# EasyEDA Pro project DJ Controller Circuit.eprj

# Schematic Schematic1
Board Name: Board1; Create Date: 2025-10-14; Page Name: P1; Project Name: DJ Controller Circuit; Schematic Name: Schematic1; Update Date: 2025-10-14; Company: EasyEDA.com; Page Size: A4; Version: V1.0
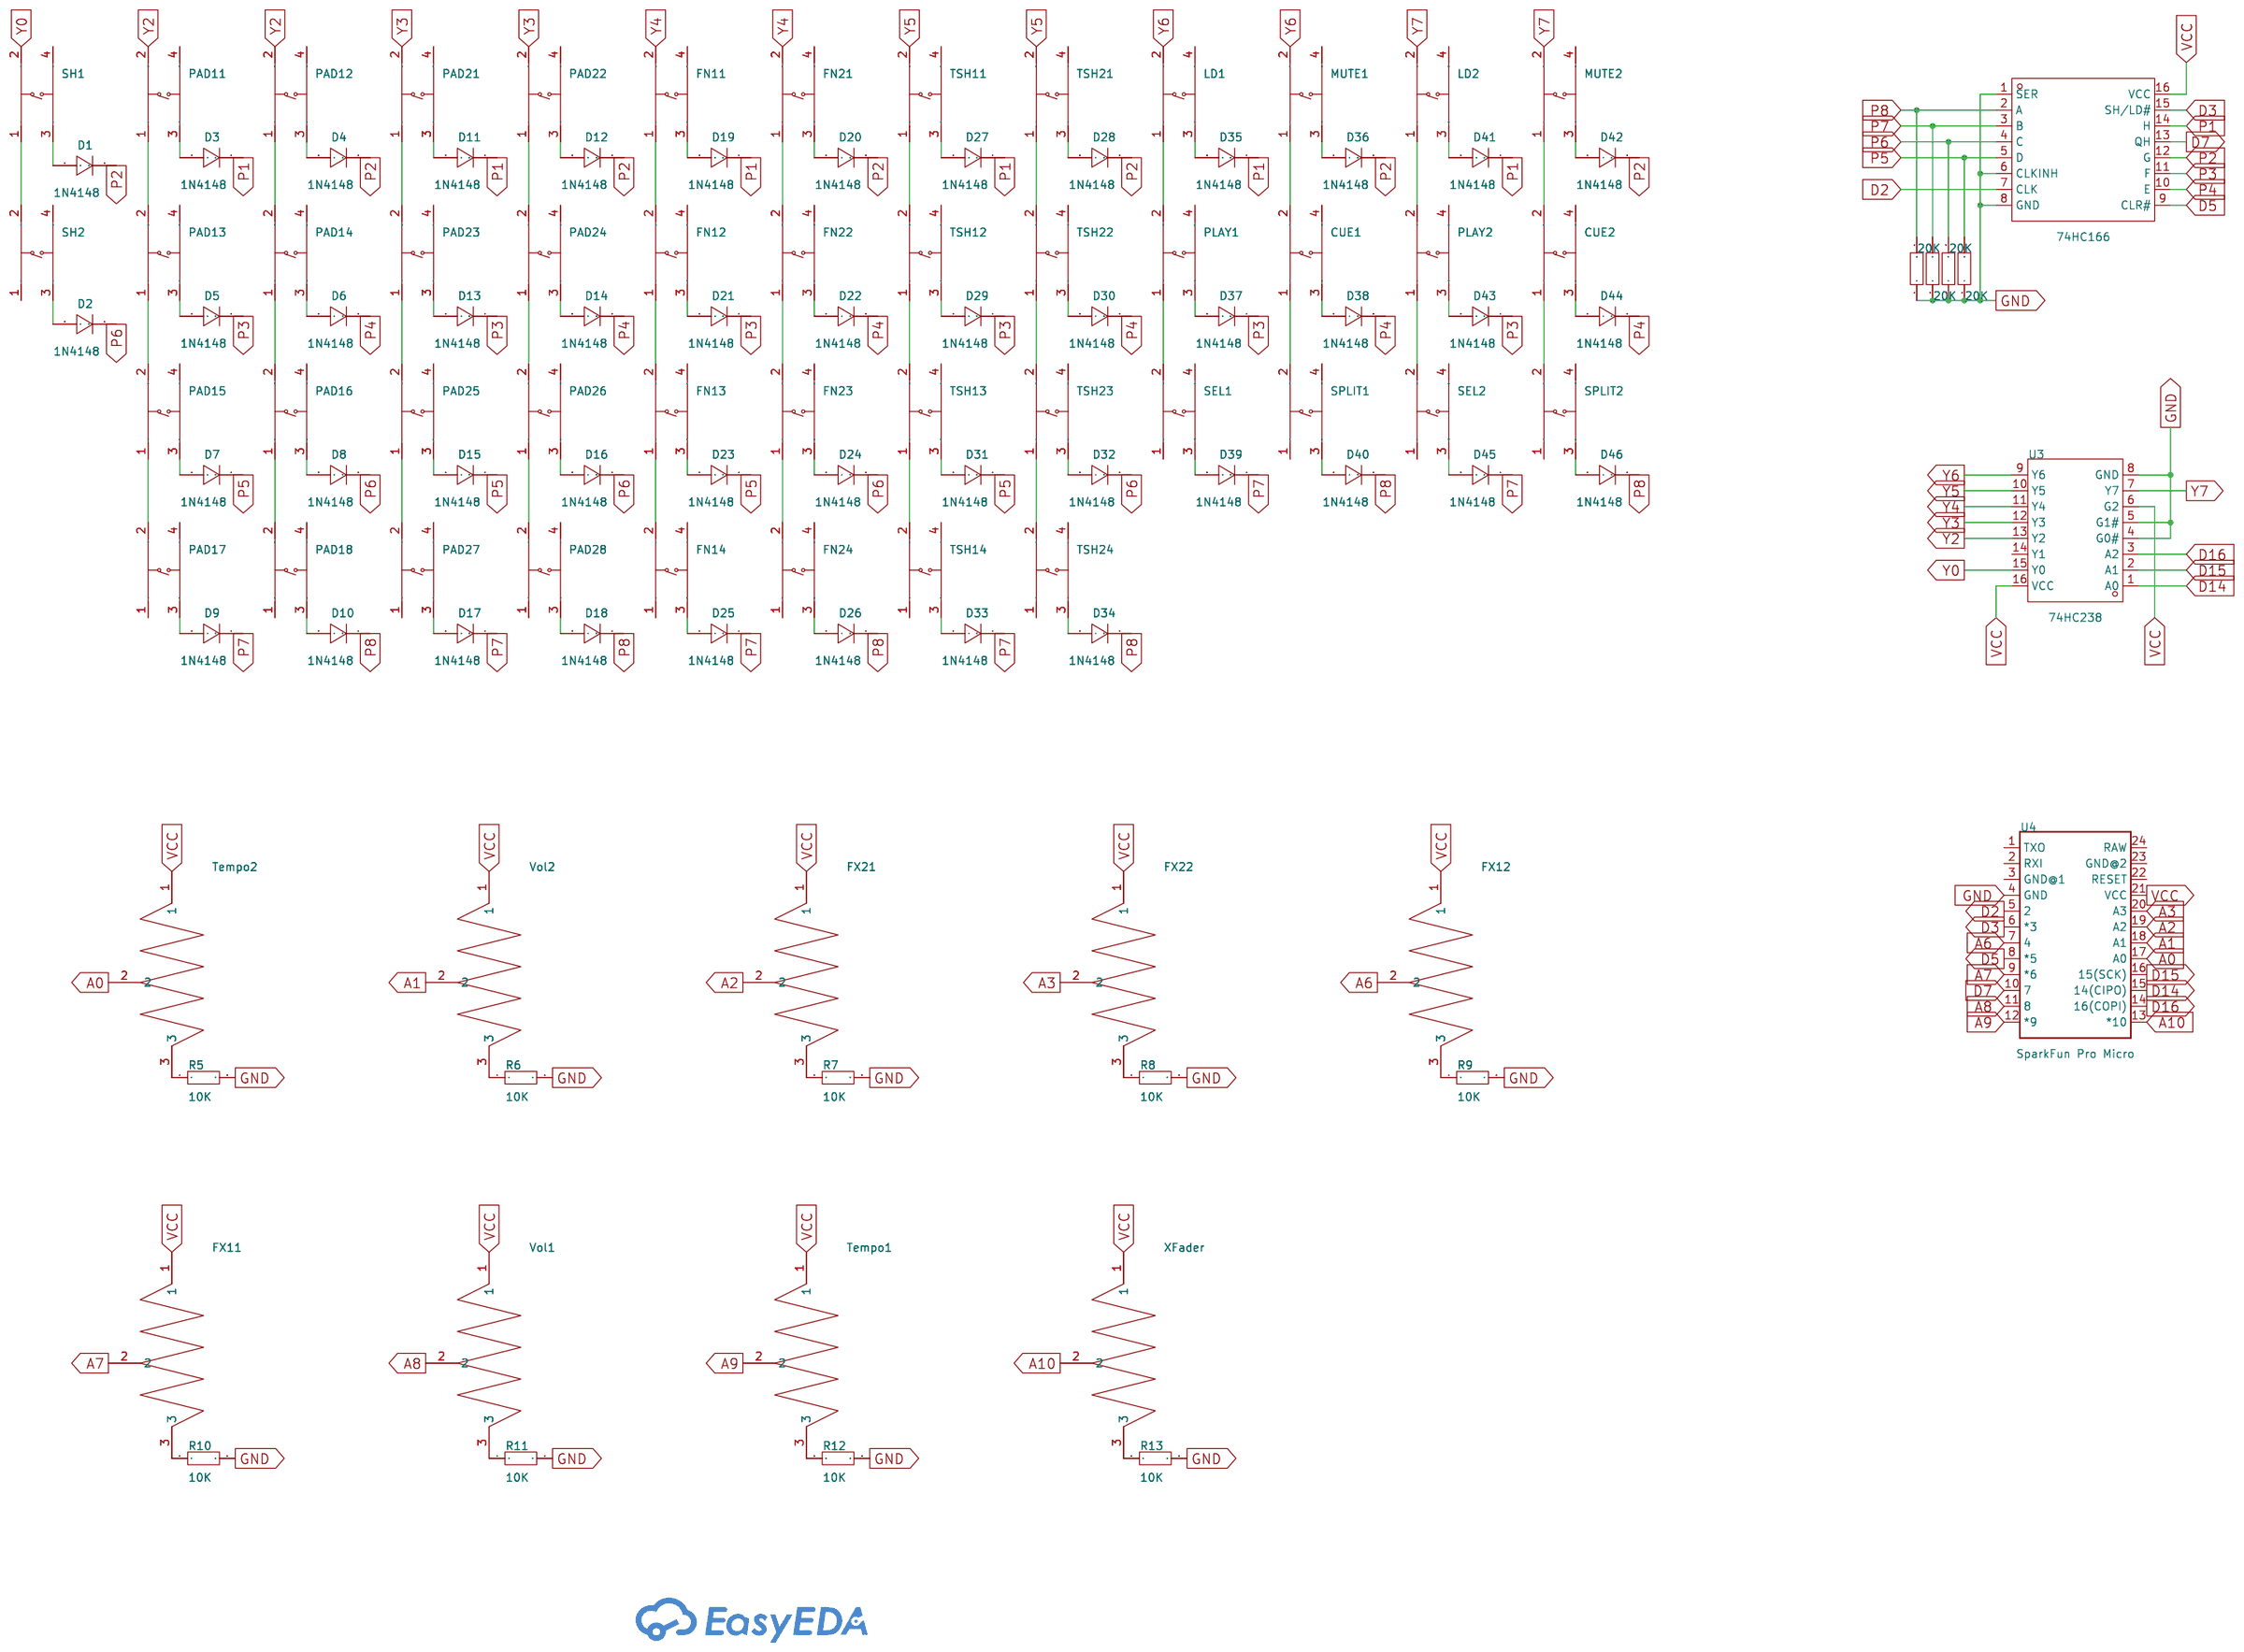
[diagram p0: schematic sheet]

## Parts
CUE1  TS665CJ  [SW-TH_4P-L6.0-W6.0-P4.50-LS6.5]
CUE2  TS665CJ  [SW-TH_4P-L6.0-W6.0-P4.50-LS6.5]
D1  1N4148  [DO-35_BD2.0-L4.2-P8.20-D0.5-RD]
D2  1N4148  [DO-35_BD2.0-L4.2-P8.20-D0.5-RD]
D3  1N4148  [DO-35_BD2.0-L4.2-P8.20-D0.5-RD]
D4  1N4148  [DO-35_BD2.0-L4.2-P8.20-D0.5-RD]
D5  1N4148  [DO-35_BD2.0-L4.2-P8.20-D0.5-RD]
D6  1N4148  [DO-35_BD2.0-L4.2-P8.20-D0.5-RD]
D7  1N4148  [DO-35_BD2.0-L4.2-P8.20-D0.5-RD]
D8  1N4148  [DO-35_BD2.0-L4.2-P8.20-D0.5-RD]
D9  1N4148  [DO-35_BD2.0-L4.2-P8.20-D0.5-RD]
D10  1N4148  [DO-35_BD2.0-L4.2-P8.20-D0.5-RD]
D11  1N4148  [DO-35_BD2.0-L4.2-P8.20-D0.5-RD]
D12  1N4148  [DO-35_BD2.0-L4.2-P8.20-D0.5-RD]
D13  1N4148  [DO-35_BD2.0-L4.2-P8.20-D0.5-RD]
D14  1N4148  [DO-35_BD2.0-L4.2-P8.20-D0.5-RD]
D15  1N4148  [DO-35_BD2.0-L4.2-P8.20-D0.5-RD]
D16  1N4148  [DO-35_BD2.0-L4.2-P8.20-D0.5-RD]
D17  1N4148  [DO-35_BD2.0-L4.2-P8.20-D0.5-RD]
D18  1N4148  [DO-35_BD2.0-L4.2-P8.20-D0.5-RD]
D19  1N4148  [DO-35_BD2.0-L4.2-P8.20-D0.5-RD]
D20  1N4148  [DO-35_BD2.0-L4.2-P8.20-D0.5-RD]
D21  1N4148  [DO-35_BD2.0-L4.2-P8.20-D0.5-RD]
D22  1N4148  [DO-35_BD2.0-L4.2-P8.20-D0.5-RD]
D23  1N4148  [DO-35_BD2.0-L4.2-P8.20-D0.5-RD]
D24  1N4148  [DO-35_BD2.0-L4.2-P8.20-D0.5-RD]
D25  1N4148  [DO-35_BD2.0-L4.2-P8.20-D0.5-RD]
D26  1N4148  [DO-35_BD2.0-L4.2-P8.20-D0.5-RD]
D27  1N4148  [DO-35_BD2.0-L4.2-P8.20-D0.5-RD]
D28  1N4148  [DO-35_BD2.0-L4.2-P8.20-D0.5-RD]
D29  1N4148  [DO-35_BD2.0-L4.2-P8.20-D0.5-RD]
D30  1N4148  [DO-35_BD2.0-L4.2-P8.20-D0.5-RD]
D31  1N4148  [DO-35_BD2.0-L4.2-P8.20-D0.5-RD]
D32  1N4148  [DO-35_BD2.0-L4.2-P8.20-D0.5-RD]
D33  1N4148  [DO-35_BD2.0-L4.2-P8.20-D0.5-RD]
D34  1N4148  [DO-35_BD2.0-L4.2-P8.20-D0.5-RD]
D35  1N4148  [DO-35_BD2.0-L4.2-P8.20-D0.5-RD]
D36  1N4148  [DO-35_BD2.0-L4.2-P8.20-D0.5-RD]
D37  1N4148  [DO-35_BD2.0-L4.2-P8.20-D0.5-RD]
D38  1N4148  [DO-35_BD2.0-L4.2-P8.20-D0.5-RD]
D39  1N4148  [DO-35_BD2.0-L4.2-P8.20-D0.5-RD]
D40  1N4148  [DO-35_BD2.0-L4.2-P8.20-D0.5-RD]
D41  1N4148  [DO-35_BD2.0-L4.2-P8.20-D0.5-RD]
D42  1N4148  [DO-35_BD2.0-L4.2-P8.20-D0.5-RD]
D43  1N4148  [DO-35_BD2.0-L4.2-P8.20-D0.5-RD]
D44  1N4148  [DO-35_BD2.0-L4.2-P8.20-D0.5-RD]
D45  1N4148  [DO-35_BD2.0-L4.2-P8.20-D0.5-RD]
D46  1N4148  [DO-35_BD2.0-L4.2-P8.20-D0.5-RD]
FN11  TS665CJ  [SW-TH_4P-L6.0-W6.0-P4.50-LS6.5]
FN12  TS665CJ  [SW-TH_4P-L6.0-W6.0-P4.50-LS6.5]
FN13  TS665CJ  [SW-TH_4P-L6.0-W6.0-P4.50-LS6.5]
FN14  TS665CJ  [SW-TH_4P-L6.0-W6.0-P4.50-LS6.5]
FN21  TS665CJ  [SW-TH_4P-L6.0-W6.0-P4.50-LS6.5]
FN22  TS665CJ  [SW-TH_4P-L6.0-W6.0-P4.50-LS6.5]
FN23  TS665CJ  [SW-TH_4P-L6.0-W6.0-P4.50-LS6.5]
FN24  TS665CJ  [SW-TH_4P-L6.0-W6.0-P4.50-LS6.5]
FX11  -  [WIW3386P]
FX12  -  [WIW3386P]
FX21  -  [WIW3386P]
FX22  -  [WIW3386P]
LD1  TS665CJ  [SW-TH_4P-L6.0-W6.0-P4.50-LS6.5]
LD2  TS665CJ  [SW-TH_4P-L6.0-W6.0-P4.50-LS6.5]
MUTE1  TS665CJ  [SW-TH_4P-L6.0-W6.0-P4.50-LS6.5]
MUTE2  TS665CJ  [SW-TH_4P-L6.0-W6.0-P4.50-LS6.5]
PAD11  TS665CJ  [SW-TH_4P-L6.0-W6.0-P4.50-LS6.5]
PAD12  TS665CJ  [SW-TH_4P-L6.0-W6.0-P4.50-LS6.5]
PAD13  TS665CJ  [SW-TH_4P-L6.0-W6.0-P4.50-LS6.5]
PAD14  TS665CJ  [SW-TH_4P-L6.0-W6.0-P4.50-LS6.5]
PAD15  TS665CJ  [SW-TH_4P-L6.0-W6.0-P4.50-LS6.5]
PAD16  TS665CJ  [SW-TH_4P-L6.0-W6.0-P4.50-LS6.5]
PAD17  TS665CJ  [SW-TH_4P-L6.0-W6.0-P4.50-LS6.5]
PAD18  TS665CJ  [SW-TH_4P-L6.0-W6.0-P4.50-LS6.5]
PAD21  TS665CJ  [SW-TH_4P-L6.0-W6.0-P4.50-LS6.5]
PAD22  TS665CJ  [SW-TH_4P-L6.0-W6.0-P4.50-LS6.5]
PAD23  TS665CJ  [SW-TH_4P-L6.0-W6.0-P4.50-LS6.5]
PAD24  TS665CJ  [SW-TH_4P-L6.0-W6.0-P4.50-LS6.5]
PAD25  TS665CJ  [SW-TH_4P-L6.0-W6.0-P4.50-LS6.5]
PAD26  TS665CJ  [SW-TH_4P-L6.0-W6.0-P4.50-LS6.5]
PAD27  TS665CJ  [SW-TH_4P-L6.0-W6.0-P4.50-LS6.5]
PAD28  TS665CJ  [SW-TH_4P-L6.0-W6.0-P4.50-LS6.5]
PLAY1  TS665CJ  [SW-TH_4P-L6.0-W6.0-P4.50-LS6.5]
PLAY2  TS665CJ  [SW-TH_4P-L6.0-W6.0-P4.50-LS6.5]
R1  20K  [RES-TH_BD2.3-L6.5-P10.50-D0.5]
R2  20K  [RES-TH_BD2.3-L6.5-P10.50-D0.5]
R3  20K  [RES-TH_BD2.3-L6.5-P10.50-D0.5]
R4  20K  [RES-TH_BD2.3-L6.5-P10.50-D0.5]
R5  10K  [RES-TH_BD2.3-L6.5-P10.50-D0.5]
R6  10K  [RES-TH_BD2.3-L6.5-P10.50-D0.5]
R7  10K  [RES-TH_BD2.3-L6.5-P10.50-D0.5]
R8  10K  [RES-TH_BD2.3-L6.5-P10.50-D0.5]
R9  10K  [RES-TH_BD2.3-L6.5-P10.50-D0.5]
R10  10K  [RES-TH_BD2.3-L6.5-P10.50-D0.5]
R11  10K  [RES-TH_BD2.3-L6.5-P10.50-D0.5]
R12  10K  [RES-TH_BD2.3-L6.5-P10.50-D0.5]
R13  10K  [RES-TH_BD2.3-L6.5-P10.50-D0.5]
SEL1  TS665CJ  [SW-TH_4P-L6.0-W6.0-P4.50-LS6.5]
SEL2  TS665CJ  [SW-TH_4P-L6.0-W6.0-P4.50-LS6.5]
SH1  TS665CJ  [SW-TH_4P-L6.0-W6.0-P4.50-LS6.5]
SH2  TS665CJ  [SW-TH_4P-L6.0-W6.0-P4.50-LS6.5]
SPLIT1  TS665CJ  [SW-TH_4P-L6.0-W6.0-P4.50-LS6.5]
SPLIT2  TS665CJ  [SW-TH_4P-L6.0-W6.0-P4.50-LS6.5]
Tempo1  -  [DM4070]
Tempo2  -  [DM4070]
TSH11  TS665CJ  [SW-TH_4P-L6.0-W6.0-P4.50-LS6.5]
TSH12  TS665CJ  [SW-TH_4P-L6.0-W6.0-P4.50-LS6.5]
TSH13  TS665CJ  [SW-TH_4P-L6.0-W6.0-P4.50-LS6.5]
TSH14  TS665CJ  [SW-TH_4P-L6.0-W6.0-P4.50-LS6.5]
TSH21  TS665CJ  [SW-TH_4P-L6.0-W6.0-P4.50-LS6.5]
TSH22  TS665CJ  [SW-TH_4P-L6.0-W6.0-P4.50-LS6.5]
TSH23  TS665CJ  [SW-TH_4P-L6.0-W6.0-P4.50-LS6.5]
TSH24  TS665CJ  [SW-TH_4P-L6.0-W6.0-P4.50-LS6.5]
U2  74HC166  [DIP-16_L20.0-W6.4-P2.54-LS7.6-BL]
U3  74HC238  [PDIP-16_L19.3-W6.4-P2.54-LS7.9-BL]
U4  SparkFun Pro Micro  [SPARKFUN_PRO_MICRO]
Vol1  -  [DM4070]
Vol2  -  [DM4070]
XFader  -  [DM4070]

## Library data of the parts
CUE1 CUE2 FN11-FN14 FN21-FN24 LD1 LD2 MUTE1 MUTE2 PAD11-PAD18 PAD21-PAD28 PLAY1 PLAY2 SEL1 SEL2 SH1 SH2 SPLIT1 SPLIT2 TSH11-TSH14 TSH21-TSH24 = TS665CJ: LCSC Part Name: 6*6*5mm 直插 轻触开关; Supplier Part: C393938; Manufacturer: SHOU HAN(首韩); Supplier Footprint: 插件; JLCPCB Part Class: Extended Part; Datasheet: https://atta.szlcsc.com/upload/public/pdf/source/20190521/C393938_BDABEAC600B4C55E200A80AA129B70BC.pdf; Supplier: LCSC; Circuit: SPST; Actuator Style: Round Button; Mounting Style: Straight; Switch Length: 6mm; Switch Width: 6mm; Switch Height: 5mm; Contact Current: 50mA; Voltage Rating (DC): 12V
D1-D46 = 1N4148_C85057: Supplier Part: C85057; Manufacturer: 星海; Supplier Footprint: DO-35; JLCPCB Part Class: Extended Part; Datasheet: https://item.szlcsc.com/datasheet/1N4148/86229.html; Supplier: LCSC; Voltage - Forward(Vf@If): 1V@10mA; Voltage - DC Reverse(Vr): 100V; Current - Rectified: 150mA; Pd - Power Dissipation: 500mW; Reverse Leakage Current (Ir): 5uA@75V; Reverse Recovery Time (trr): 4ns; Operating Junction Temperature Range: -65℃~+200℃@(Tj); Non-Repetitive Peak Forward Surge Current: 500mA
FX11 FX12 FX21 FX22 Tempo1 Tempo2 Vol1 Vol2 XFader = DM4070
R1-R13 = Res_0603: Supplier Footprint: 0603
U2 = SN74HC166N: LCSC Part Name: 推挽式输出 8位并行或串行至串行移位寄存器; Supplier Part: C2905; Manufacturer: TI(德州仪器); Supplier Footprint: DIP-16; JLCPCB Part Class: Extended Part; Datasheet: https://www.ti.com/cn/lit/gpn/sn74hc166; Supplier: LCSC; Function: ParallelorSerialtoSerial; Supply Voltage: 2V~6V; Number of Elements: 1; Number of Bits per Element: 8; Output Type: Push-pull; Operating Temperature: -40℃~+85℃
U3 = CD74HC238E: Supplier Part: C1547095; Manufacturer: TI(德州仪器); Supplier Footprint: PDIP-16; JLCPCB Part Class: Extended Part; Datasheet: https://www.ti.com/cn/lit/gpn/cd74hc238; Supplier: LCSC; Type: Decoder/Demultiplexers; Voltage Supply Source: Single supply; Voltage - Supply: 2V~6V; Current - Output Low(IOL): 5.2mA; Current - Output High(IOH): 5.2mA; Operating temperature: -55℃~+125℃
U4 = SPARKFUN_PRO_MICRO

## Nets
GND: R1.1 R2.1 R3.1 R4.1 R5.2 R6.2 R7.2 R8.2 R9.2 R10.2 R11.2 R12.2 R13.2 U2.1(SER) U2.6(CLKINH) U2.8(GND) U3.4(G0#) U3.5(G1#) U3.8(GND) U4.4(GND)
VCC: FX11.1 FX12.1 FX21.1 FX22.1 Tempo1.1 Tempo2.1 U2.16(VCC) U3.6(G2) U3.16(VCC) U4.21(VCC) Vol1.1 Vol2.1 XFader.1
A0: Tempo2.2 U4.17(A0)
A1: U4.18(A1) Vol2.2
A2: FX21.2 U4.19(A2)
A3: FX22.2 U4.20(A3)
A6: FX12.2 U4.7(4)
A7: FX11.2 U4.9(*6)
A8: U4.11(8) Vol1.2
A9: Tempo1.2 U4.12(*9)
A10: U4.13(*10) XFader.2
D2: U2.7(CLK) U4.5(2)
D3: U2.15(SH/LD#) U4.6(*3)
D5: U2.9(CLR#) U4.8(*5)
D7: U2.13(QH) U4.10(7)
D14: U3.1(A0) U4.15(14(CIPO))
D15: U3.2(A1) U4.16(15(SCK))
D16: U3.3(A2) U4.14(16(COPI))
P1: D3.1(C) D11.1(C) D19.1(C) D27.1(C) D35.1(C) D41.1(C) U2.14(H)
P2: D1.1(C) D4.1(C) D12.1(C) D20.1(C) D28.1(C) D36.1(C) D42.1(C) U2.12(G)
P3: D5.1(C) D13.1(C) D21.1(C) D29.1(C) D37.1(C) D43.1(C) U2.11(F)
P4: D6.1(C) D14.1(C) D22.1(C) D30.1(C) D38.1(C) D44.1(C) U2.10(E)
P5: D7.1(C) D15.1(C) D23.1(C) D31.1(C) R4.2 U2.5(D)
P6: D2.1(C) D8.1(C) D16.1(C) D24.1(C) D32.1(C) R3.2 U2.4(C)
P7: D9.1(C) D17.1(C) D25.1(C) D33.1(C) D39.1(C) D45.1(C) R2.2 U2.3(B)
P8: D10.1(C) D18.1(C) D26.1(C) D34.1(C) D40.1(C) D46.1(C) R1.2 U2.2(A)
Y0: SH1.2(B) U3.15(Y0)
Y2: PAD11.2(B) PAD12.2(B) U3.13(Y2)
Y3: PAD21.2(B) PAD22.2(B) U3.12(Y3)
Y4: FN11.2(B) FN21.2(B) U3.11(Y4)
Y5: TSH11.2(B) TSH21.2(B) U3.10(Y5)
Y6: LD1.2(B) MUTE1.2(B) U3.9(Y6)
Y7: LD2.2(B) MUTE2.2(B) U3.7(Y7)
$1N2965: SH1.1(A) SH2.2(B)
$1N3300: PAD11.1(A) PAD13.2(B)
$1N3304: PAD13.1(A) PAD15.2(B)
$1N3309: PAD15.1(A) PAD17.2(B)
$1N3347: PAD12.1(A) PAD14.2(B)
$1N3352: PAD14.1(A) PAD16.2(B)
$1N3357: PAD16.1(A) PAD18.2(B)
$1N3407: PAD21.1(A) PAD23.2(B)
$1N3411: PAD23.1(A) PAD25.2(B)
$1N3416: PAD25.1(A) PAD27.2(B)
$1N3421: PAD22.1(A) PAD24.2(B)
$1N3426: PAD24.1(A) PAD26.2(B)
$1N3431: PAD26.1(A) PAD28.2(B)
$1N3760: D13.2(A) PAD23.3(C)
$1N3765: D11.2(A) PAD21.3(C)
$1N3769: D15.2(A) PAD25.3(C)
$1N3774: D17.2(A) PAD27.3(C)
$1N3779: D8.2(A) PAD16.3(C)
$1N3783: D10.2(A) PAD18.3(C)
$1N3788: D9.2(A) PAD17.3(C)
$1N3795: D7.2(A) PAD15.3(C)
$1N3799: D5.2(A) PAD13.3(C)
$1N3803: D3.2(A) PAD11.3(C)
$1N3807: D4.2(A) PAD12.3(C)
$1N3811: D6.2(A) PAD14.3(C)
$1N3815: D18.2(A) PAD28.3(C)
$1N3819: D16.2(A) PAD26.3(C)
$1N3824: D14.2(A) PAD24.3(C)
$1N3828: D12.2(A) PAD22.3(C)
$1N4146: FN11.1(A) FN12.2(B)
$1N4150: FN12.1(A) FN13.2(B)
$1N4155: FN13.1(A) FN14.2(B)
$1N4160: FN23.1(A) FN24.2(B)
$1N4165: FN22.1(A) FN23.2(B)
$1N4170: FN21.1(A) FN22.2(B)
$1N4175: D19.2(A) FN11.3(C)
$1N4180: D21.2(A) FN12.3(C)
$1N4185: D23.2(A) FN13.3(C)
$1N4190: D25.2(A) FN14.3(C)
$1N4195: D26.2(A) FN24.3(C)
$1N4200: D24.2(A) FN23.3(C)
$1N4205: D22.2(A) FN22.3(C)
$1N4210: D20.2(A) FN21.3(C)
$1N4566: D33.2(A) TSH14.3(C)
$1N4570: D34.2(A) TSH24.3(C)
$1N4575: TSH13.1(A) TSH14.2(B)
$1N4580: D31.2(A) TSH13.3(C)
$1N4585: TSH23.1(A) TSH24.2(B)
$1N4590: D32.2(A) TSH23.3(C)
$1N4595: D30.2(A) TSH22.3(C)
$1N4600: TSH22.1(A) TSH23.2(B)
$1N4605: TSH12.1(A) TSH13.2(B)
$1N4610: D29.2(A) TSH12.3(C)
$1N4615: TSH11.1(A) TSH12.2(B)
$1N4620: D27.2(A) TSH11.3(C)
$1N4625: TSH21.1(A) TSH22.2(B)
$1N4630: D28.2(A) TSH21.3(C)
$1N4869: LD1.1(A) PLAY1.2(B)
$1N4873: PLAY1.1(A) SEL1.2(B)
$1N4878: D39.2(A) SEL1.3(C)
$1N4883: D37.2(A) PLAY1.3(C)
$1N4888: D35.2(A) LD1.3(C)
$1N4893: CUE1.2(B) MUTE1.1(A)
$1N4898: D36.2(A) MUTE1.3(C)
$1N4903: CUE1.3(C) D38.2(A)
$1N4908: CUE1.1(A) SPLIT1.2(B)
$1N4913: D40.2(A) SPLIT1.3(C)
$1N5152: D46.2(A) SPLIT2.3(C)
$1N5156: D45.2(A) SEL2.3(C)
$1N5161: D43.2(A) PLAY2.3(C)
$1N5166: CUE2.3(C) D44.2(A)
$1N5171: CUE2.1(A) SPLIT2.2(B)
$1N5176: PLAY2.1(A) SEL2.2(B)
$1N5184: LD2.1(A) PLAY2.2(B)
$1N5188: D41.2(A) LD2.3(C)
$1N5193: CUE2.2(B) MUTE2.1(A)
$1N5198: D42.2(A) MUTE2.3(C)
$1N7617: D2.2(A) SH2.3(C)
$1N7621: D1.2(A) SH1.3(C)
$1N8914: R5.1 Tempo2.3
$1N8940: R6.1 Vol2.3
$1N8966: FX21.3 R7.1
$1N8992: FX22.3 R8.1
$1N9018: FX12.3 R9.1
$1N9156: FX11.3 R10.1
$1N9158: R11.1 Vol1.3
$1N9160: R12.1 Tempo1.3
$1N9162: R13.1 XFader.3

Not connected (* = marked no-connect by the designer): CUE1 4(D); CUE2 4(D); FN11 4(D); FN12 4(D); FN13 4(D); FN14 1(A) 4(D); FN21 4(D); FN22 4(D); FN23 4(D); FN24 1(A) 4(D); LD1 4(D); LD2 4(D); MUTE1 4(D); MUTE2 4(D); PAD11 4(D); PAD12 4(D); PAD13 4(D); PAD14 4(D); PAD15 4(D); PAD16 4(D); PAD17 1(A) 4(D); PAD18 1(A) 4(D); PAD21 4(D); PAD22 4(D); PAD23 4(D); PAD24 4(D); PAD25 4(D); PAD26 4(D); PAD27 1(A) 4(D); PAD28 1(A) 4(D); PLAY1 4(D); PLAY2 4(D); SEL1 1(A) 4(D); SEL2 1(A) 4(D); SH1 4(D); SH2 1(A) 4(D); SPLIT1 1(A) 4(D); SPLIT2 1(A) 4(D); TSH11 4(D); TSH12 4(D); TSH13 4(D); TSH14 1(A) 4(D); TSH21 4(D); TSH22 4(D); TSH23 4(D); TSH24 1(A) 4(D); U3 14(Y1); U4 1(TXO) 2(RXI) 3(GND@1) 22(RESET) 23(GND@2) 24(RAW)

# Board PCB1
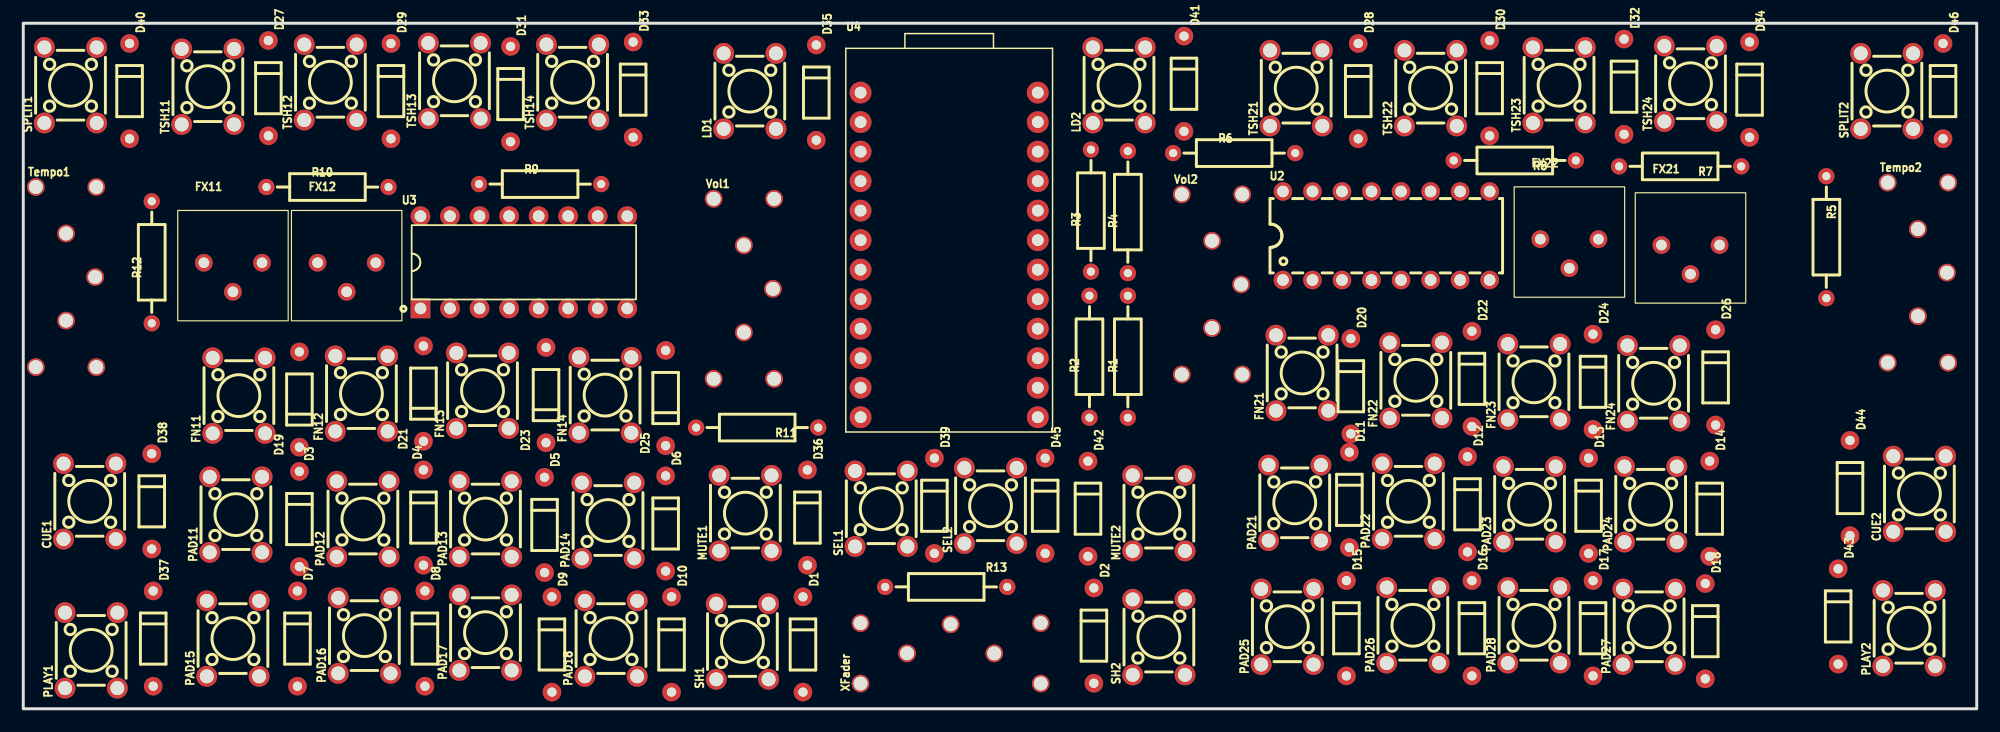
[diagram p1: board, top side]
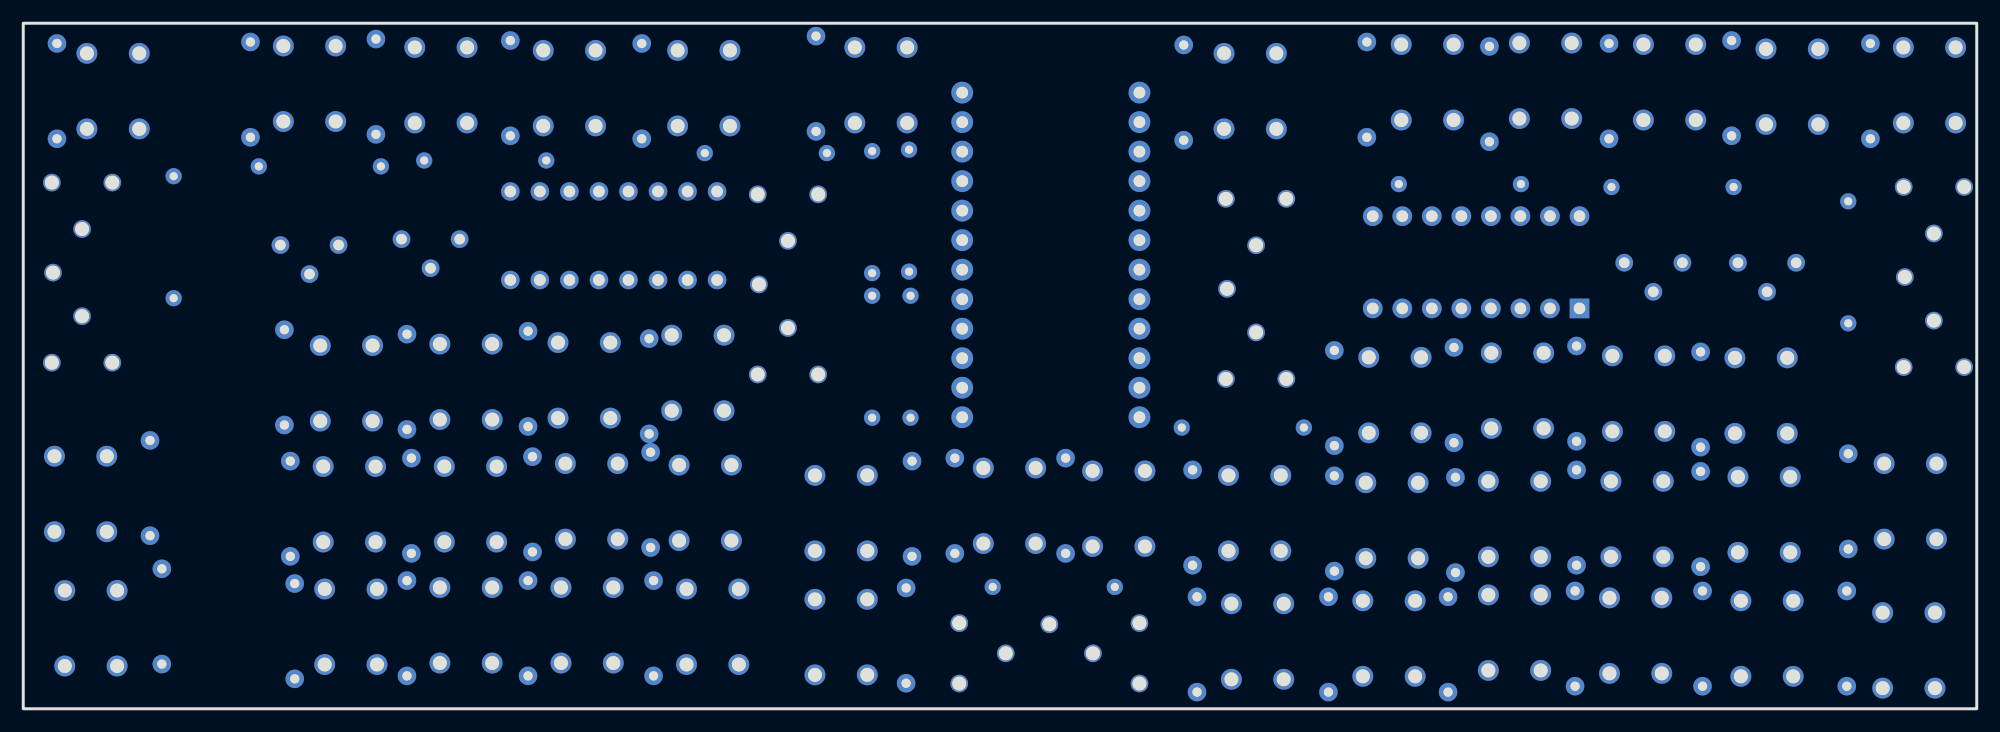
[diagram p2: board, bottom side, seen from below]

Outline 168 x 59 mm; copper layers: Top Layer, Bottom Layer. Coordinates in mm from the lower left corner of the outline.
Outline path: rectangle 0,59 168,0
Stack: Top Layer 0.035mm / Dielectric1 1.51mm FR4 er 4.5 / Bottom Layer 0.035mm

## Design rules (mm)
template: JLCPCB Capability(Two Layers Board)
spacing copperThickness1oz (default): track to track 0.102, other pairs 0.152 to 0.3
spacing copperThickness2oz: track to track 0.203, other pairs 0.152 to 0.3
track width copperThickness1oz (default): min 0.127, default 0.254, max 2.54
track width copperThickness2oz: min 0.203, default 0.254, max 2.54
differential pair differentialPair (default): width min 0.127, default 0.254, max 2.54; gap min 0.152, default 0.152
via viaSize (default): diameter min 0.5, default 0.61, max 10; hole min 0.3, default 0.305, max 6.3

## Placement (name value [footprint] x y rotation side)
CUE1  TS665CJ  [SW-TH_4P-L6.0-W6.0-P4.50-LS6.5]  5.72 17.85 90 top
CUE2  TS665CJ  [SW-TH_4P-L6.0-W6.0-P4.50-LS6.5]  163.07 18.49 90 top
D1  1N4148  [DO-35_BD2.0-L4.2-P8.20-D0.5-RD]  67.06 5.53 270 top
D2  1N4148  [DO-35_BD2.0-L4.2-P8.20-D0.5-RD]  92.07 6.3 270 top
D3  1N4148  [DO-35_BD2.0-L4.2-P8.20-D0.5-RD]  23.75 16.33 270 top
D4  1N4148  [DO-35_BD2.0-L4.2-P8.20-D0.5-RD]  34.42 16.46 270 top
D5  1N4148  [DO-35_BD2.0-L4.2-P8.20-D0.5-RD]  44.83 15.82 270 top
D6  1N4148  [DO-35_BD2.0-L4.2-P8.20-D0.5-RD]  55.25 15.95 270 top
D7  1N4148  [DO-35_BD2.0-L4.2-P8.20-D0.5-RD]  23.58 6.04 270 top
D8  1N4148  [DO-35_BD2.0-L4.2-P8.20-D0.5-RD]  34.54 6.04 270 top
D9  1N4148  [DO-35_BD2.0-L4.2-P8.20-D0.5-RD]  45.47 5.53 270 top
D10  1N4148  [DO-35_BD2.0-L4.2-P8.20-D0.5-RD]  55.75 5.53 270 top
D11  1N4148  [DO-35_BD2.0-L4.2-P8.20-D0.5-RD]  114.05 17.98 270 top
D12  1N4148  [DO-35_BD2.0-L4.2-P8.20-D0.5-RD]  124.21 17.6 270 top
D13  1N4148  [DO-35_BD2.0-L4.2-P8.20-D0.5-RD]  134.62 17.47 270 top
D14  1N4148  [DO-35_BD2.0-L4.2-P8.20-D0.5-RD]  145.03 17.22 270 top
D15  1N4148  [DO-35_BD2.0-L4.2-P8.20-D0.5-RD]  113.79 6.93 270 top
D16  1N4148  [DO-35_BD2.0-L4.2-P8.20-D0.5-RD]  124.59 6.93 270 top
D17  1N4148  [DO-35_BD2.0-L4.2-P8.20-D0.5-RD]  135 6.93 270 top
D18  1N4148  [DO-35_BD2.0-L4.2-P8.20-D0.5-RD]  144.65 6.68 270 top
D19  1N4148  [DO-35_BD2.0-L4.2-P8.20-D0.5-RD]  23.75 26.62 90 top
D20  1N4148  [DO-35_BD2.0-L4.2-P8.20-D0.5-RD]  114.17 27.76 270 top
D21  1N4148  [DO-35_BD2.0-L4.2-P8.20-D0.5-RD]  34.42 27.12 90 top
D22  1N4148  [DO-35_BD2.0-L4.2-P8.20-D0.5-RD]  124.59 28.39 270 top
D23  1N4148  [DO-35_BD2.0-L4.2-P8.20-D0.5-RD]  44.96 27 90 top
D24  1N4148  [DO-35_BD2.0-L4.2-P8.20-D0.5-RD]  135 28.14 270 top
D25  1N4148  [DO-35_BD2.0-L4.2-P8.20-D0.5-RD]  55.25 26.74 90 top
D26  1N4148  [DO-35_BD2.0-L4.2-P8.20-D0.5-RD]  145.54 28.52 270 top
D27  1N4148  [DO-35_BD2.0-L4.2-P8.20-D0.5-RD]  21.08 53.41 270 top
D28  1N4148  [DO-35_BD2.0-L4.2-P8.20-D0.5-RD]  114.81 53.16 270 top
D29  1N4148  [DO-35_BD2.0-L4.2-P8.20-D0.5-RD]  31.62 53.16 270 top
D30  1N4148  [DO-35_BD2.0-L4.2-P8.20-D0.5-RD]  126.11 53.41 270 top
D31  1N4148  [DO-35_BD2.0-L4.2-P8.20-D0.5-RD]  41.91 52.9 270 top
D32  1N4148  [DO-35_BD2.0-L4.2-P8.20-D0.5-RD]  137.67 53.54 270 top
D33  1N4148  [DO-35_BD2.0-L4.2-P8.20-D0.5-RD]  52.45 53.29 270 top
D34  1N4148  [DO-35_BD2.0-L4.2-P8.20-D0.5-RD]  148.46 53.29 270 top
D35  1N4148  [DO-35_BD2.0-L4.2-P8.20-D0.5-RD]  68.2 53.03 270 top
D36  1N4148  [DO-35_BD2.0-L4.2-P8.20-D0.5-RD]  67.44 16.46 270 top
D37  1N4148  [DO-35_BD2.0-L4.2-P8.20-D0.5-RD]  11.18 6.04 270 top
D38  1N4148  [DO-35_BD2.0-L4.2-P8.20-D0.5-RD]  11.05 17.85 270 top
D39  1N4148  [DO-35_BD2.0-L4.2-P8.20-D0.5-RD]  78.36 17.47 270 top
D40  1N4148  [DO-35_BD2.0-L4.2-P8.20-D0.5-RD]  9.14 53.16 270 top
D41  1N4148  [DO-35_BD2.0-L4.2-P8.20-D0.5-RD]  99.82 53.79 270 top
D42  1N4148  [DO-35_BD2.0-L4.2-P8.20-D0.5-RD]  91.57 17.22 270 top
D43  1N4148  [DO-35_BD2.0-L4.2-P8.20-D0.5-RD]  156.08 7.95 270 top
D44  1N4148  [DO-35_BD2.0-L4.2-P8.20-D0.5-RD]  157.1 19 270 top
D45  1N4148  [DO-35_BD2.0-L4.2-P8.20-D0.5-RD]  87.88 17.47 270 top
D46  1N4148  [DO-35_BD2.0-L4.2-P8.20-D0.5-RD]  165.1 53.16 270 top
FN11  TS665CJ  [SW-TH_4P-L6.0-W6.0-P4.50-LS6.5]  18.55 26.95 90 top
FN12  TS665CJ  [SW-TH_4P-L6.0-W6.0-P4.50-LS6.5]  29.08 27.12 90 top
FN13  TS665CJ  [SW-TH_4P-L6.0-W6.0-P4.50-LS6.5]  39.5 27.38 90 top
FN14  TS665CJ  [SW-TH_4P-L6.0-W6.0-P4.50-LS6.5]  50.04 27 90 top
FN21  TS665CJ  [SW-TH_4P-L6.0-W6.0-P4.50-LS6.5]  109.98 28.9 90 top
FN22  TS665CJ  [SW-TH_4P-L6.0-W6.0-P4.50-LS6.5]  119.76 28.27 90 top
FN23  TS665CJ  [SW-TH_4P-L6.0-W6.0-P4.50-LS6.5]  129.92 28.14 90 top
FN24  TS665CJ  [SW-TH_4P-L6.0-W6.0-P4.50-LS6.5]  140.21 28.01 90 top
FX11  -  [WIW3386P]  18.03 35.89 0 top
FX12  -  [WIW3386P]  27.81 35.89 0 top
FX21  -  [WIW3386P]  143.38 37.41 0 top
FX22  -  [WIW3386P]  132.97 37.92 0 top
LD1  TS665CJ  [SW-TH_4P-L6.0-W6.0-P4.50-LS6.5]  62.48 53.16 90 top
LD2  TS665CJ  [SW-TH_4P-L6.0-W6.0-P4.50-LS6.5]  94.23 53.67 90 top
MUTE1  TS665CJ  [SW-TH_4P-L6.0-W6.0-P4.50-LS6.5]  62.1 16.84 90 top
MUTE2  TS665CJ  [SW-TH_4P-L6.0-W6.0-P4.50-LS6.5]  97.66 16.84 90 top
PAD11  TS665CJ  [SW-TH_4P-L6.0-W6.0-P4.50-LS6.5]  18.29 16.71 90 top
PAD12  TS665CJ  [SW-TH_4P-L6.0-W6.0-P4.50-LS6.5]  29.21 16.33 90 top
PAD13  TS665CJ  [SW-TH_4P-L6.0-W6.0-P4.50-LS6.5]  39.75 16.33 90 top
PAD14  TS665CJ  [SW-TH_4P-L6.0-W6.0-P4.50-LS6.5]  50.29 16.2 90 top
PAD15  TS665CJ  [SW-TH_4P-L6.0-W6.0-P4.50-LS6.5]  18.03 6.04 90 top
PAD16  TS665CJ  [SW-TH_4P-L6.0-W6.0-P4.50-LS6.5]  29.34 6.3 90 top
PAD17  TS665CJ  [SW-TH_4P-L6.0-W6.0-P4.50-LS6.5]  39.75 6.55 90 top
PAD18  TS665CJ  [SW-TH_4P-L6.0-W6.0-P4.50-LS6.5]  50.55 6.04 90 top
PAD21  TS665CJ  [SW-TH_4P-L6.0-W6.0-P4.50-LS6.5]  109.35 17.73 90 top
PAD22  TS665CJ  [SW-TH_4P-L6.0-W6.0-P4.50-LS6.5]  119.13 17.85 90 top
PAD23  TS665CJ  [SW-TH_4P-L6.0-W6.0-P4.50-LS6.5]  129.54 17.6 90 top
PAD24  TS665CJ  [SW-TH_4P-L6.0-W6.0-P4.50-LS6.5]  139.95 17.6 90 top
PAD25  TS665CJ  [SW-TH_4P-L6.0-W6.0-P4.50-LS6.5]  108.71 7.06 90 top
PAD26  TS665CJ  [SW-TH_4P-L6.0-W6.0-P4.50-LS6.5]  119.51 7.18 90 top
PAD27  TS665CJ  [SW-TH_4P-L6.0-W6.0-P4.50-LS6.5]  139.83 7.06 90 top
PAD28  TS665CJ  [SW-TH_4P-L6.0-W6.0-P4.50-LS6.5]  129.92 7.18 90 top
PLAY1  TS665CJ  [SW-TH_4P-L6.0-W6.0-P4.50-LS6.5]  5.84 5.03 90 top
PLAY2  TS665CJ  [SW-TH_4P-L6.0-W6.0-P4.50-LS6.5]  162.18 6.93 90 top
R1  20K  [RES-TH_BD2.3-L6.5-P10.50-D0.5]  95 30.3 90 top
R2  20K  [RES-TH_BD2.3-L6.5-P10.50-D0.5]  91.69 30.3 90 top
R3  20K  [RES-TH_BD2.3-L6.5-P10.50-D0.5]  91.82 42.87 90 top
R4  20K  [RES-TH_BD2.3-L6.5-P10.50-D0.5]  95 42.74 90 top
R5  10K  [RES-TH_BD2.3-L6.5-P10.50-D0.5]  155.07 40.59 270 top
R6  10K  [RES-TH_BD2.3-L6.5-P10.50-D0.5]  104.14 47.82 0 top
R7  10K  [RES-TH_BD2.3-L6.5-P10.50-D0.5]  142.49 46.68 180 top
R8  10K  [RES-TH_BD2.3-L6.5-P10.50-D0.5]  128.27 47.19 180 top
R9  10K  [RES-TH_BD2.3-L6.5-P10.50-D0.5]  44.45 45.16 0 top
R10  10K  [RES-TH_BD2.3-L6.5-P10.50-D0.5]  26.16 44.9 0 top
R11  10K  [RES-TH_BD2.3-L6.5-P10.50-D0.5]  63.12 24.2 180 top
R12  10K  [RES-TH_BD2.3-L6.5-P10.50-D0.5]  11.05 38.43 90 top
R13  10K  [RES-TH_BD2.3-L6.5-P10.50-D0.5]  79.38 10.49 180 top
SEL1  TS665CJ  [SW-TH_4P-L6.0-W6.0-P4.50-LS6.5]  73.79 17.22 90 top
SEL2  TS665CJ  [SW-TH_4P-L6.0-W6.0-P4.50-LS6.5]  83.19 17.47 90 top
SH1  TS665CJ  [SW-TH_4P-L6.0-W6.0-P4.50-LS6.5]  61.85 5.79 90 top
SH2  TS665CJ  [SW-TH_4P-L6.0-W6.0-P4.50-LS6.5]  97.66 6.17 90 top
SPLIT1  TS665CJ  [SW-TH_4P-L6.0-W6.0-P4.50-LS6.5]  4.06 53.67 90 top
SPLIT2  TS665CJ  [SW-TH_4P-L6.0-W6.0-P4.50-LS6.5]  160.27 53.16 90 top
Tempo1  -  [DM4070]  3.68 37.16 0 top
Tempo2  -  [DM4070]  162.94 37.54 0 top
TSH11  TS665CJ  [SW-TH_4P-L6.0-W6.0-P4.50-LS6.5]  15.88 53.54 90 top
TSH12  TS665CJ  [SW-TH_4P-L6.0-W6.0-P4.50-LS6.5]  26.42 53.92 90 top
TSH13  TS665CJ  [SW-TH_4P-L6.0-W6.0-P4.50-LS6.5]  37.08 54.05 90 top
TSH14  TS665CJ  [SW-TH_4P-L6.0-W6.0-P4.50-LS6.5]  47.24 53.92 90 top
TSH21  TS665CJ  [SW-TH_4P-L6.0-W6.0-P4.50-LS6.5]  109.47 53.41 90 top
TSH22  TS665CJ  [SW-TH_4P-L6.0-W6.0-P4.50-LS6.5]  121.03 53.41 90 top
TSH23  TS665CJ  [SW-TH_4P-L6.0-W6.0-P4.50-LS6.5]  132.08 53.67 90 top
TSH24  TS665CJ  [SW-TH_4P-L6.0-W6.0-P4.50-LS6.5]  143.38 53.79 90 top
U2  74HC166  [DIP-16_L20.0-W6.4-P2.54-LS7.6-BL]  117.22 40.71 0 top
U3  74HC238  [PDIP-16_L19.3-W6.4-P2.54-LS7.9-BL]  43.05 38.43 0 top
U4  SparkFun Pro Micro  [SPARKFUN_PRO_MICRO]  79.63 40.33 0 top
Vol1  -  [DM4070]  61.98 36.14 0 top
Vol2  -  [DM4070]  102.23 36.52 0 top
XFader  -  [DM4070]  79.76 4.77 90 top

## Footprints (pads in the part's own frame, mm; a bottom-side part is the same pattern mirrored in y, then rotated)
DIP-16_L20.0-W6.4-P2.54-LS7.6-BL
  round 1.6 hole 1: 1(-8.89,-3.81) 2(-6.35,-3.81) 3(-3.81,-3.81) 4(-1.27,-3.81) 5(1.27,-3.81) 6(3.81,-3.81) 7(6.35,-3.81) 8(8.89,-3.81) 9(8.89,3.81) 10(6.35,3.81) 11(3.81,3.81) 12(1.27,3.81) 13(-1.27,3.81) 14(-3.81,3.81) 15(-6.35,3.81) 16(-8.89,3.81)
DM4070
  round 1.524 hole 1.2: 1(0,3.75) 2(2.5,0) 3(0,-3.75) 4(-2.6,7.75) 5(2.6,7.75) 6(-2.6,-7.75) 7(2.6,-7.75)
DO-35_BD2.0-L4.2-P8.20-D0.5-RD
  round 1.6 hole 0.8: 1(-4.1,0) 2(4.1,0)
PDIP-16_L19.3-W6.4-P2.54-LS7.9-BL
  rect 1.7x1.7 hole 1: 1(-8.89,-3.97)
  round 1.7 hole 1: 2(-6.35,-3.97) 3(-3.81,-3.97) 4(-1.27,-3.97) 5(1.27,-3.97) 6(3.81,-3.97) 7(6.35,-3.97) 8(8.89,-3.97) 9(8.89,3.97) 10(6.35,3.97) 11(3.81,3.97) 12(1.27,3.97) 13(-1.27,3.97) 14(-3.81,3.97) 15(-6.35,3.97) 16(-8.89,3.97)
RES-TH_BD2.3-L6.5-P10.50-D0.5
  round 1.4 hole 0.7: 1(-5.25,0) 2(5.25,0)
SPARKFUN_PRO_MICRO
  round 1.879 hole 1.016: 1(-7.62,12.7) 2(-7.62,10.16) 3(-7.62,7.62) 4(-7.62,5.08) 5(-7.62,2.54) 6(-7.62,0) 7(-7.62,-2.54) 8(-7.62,-5.08) 9(-7.62,-7.62) 10(-7.62,-10.16) 11(-7.62,-12.7) 12(-7.62,-15.24) 13(7.62,-15.24) 14(7.62,-12.7) 15(7.62,-10.16) 16(7.62,-7.62) 17(7.62,-5.08) 18(7.62,-2.54) 19(7.62,0) 20(7.62,2.54) 21(7.62,5.08) 22(7.62,7.62) 23(7.62,10.16) 24(7.62,12.7)
SW-TH_4P-L6.0-W6.0-P4.50-LS6.5
  round 1.8 hole 1.2: 1(-3.25,2.25) 2(3.25,2.25) 3(-3.25,-2.25) 4(3.25,-2.25)
WIW3386P
  round 1.524 hole 0.914: 1(-2.5,2.5) 2(0,0) 3(2.5,2.5)

## Nets
As in the schematic.

Pads without a net: CUE1 4; CUE2 4; FN11 4; FN12 4; FN13 4; FN14 1 4; FN21 4; FN22 4; FN23 4; FN24 1 4; LD1 4; LD2 4; MUTE1 4; MUTE2 4; PAD11 4; PAD12 4; PAD13 4; PAD14 4; PAD15 4; PAD16 4; PAD17 1 4; PAD18 1 4; PAD21 4; PAD22 4; PAD23 4; PAD24 4; PAD25 4; PAD26 4; PAD27 1 4; PAD28 1 4; PLAY1 4; PLAY2 4; SEL1 1 4; SEL2 1 4; SH1 4; SH2 1 4; SPLIT1 1 4; SPLIT2 1 4; Tempo1 4 5 6 7; Tempo2 4 5 6 7; TSH11 4; TSH12 4; TSH13 4; TSH14 1 4; TSH21 4; TSH22 4; TSH23 4; TSH24 1 4; U3 14; U4 1 2 3 22 23 24; Vol1 4 5 6 7; Vol2 4 5 6 7; XFader 4 5 6 7

# Board PCB3
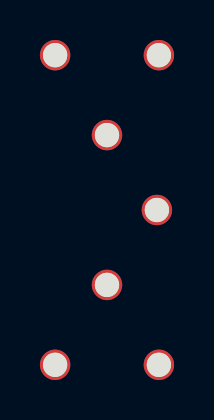
[diagram p3: board, top side]
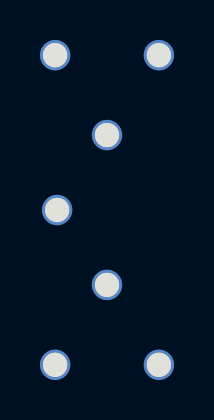
[diagram p4: board, bottom side, seen from below]

No outline. copper layers: Top Layer, Bottom Layer. Coordinates in mm from the lowest, leftmost part position.
Stack: Top Layer 0.035mm / Dielectric1 1.51mm FR4 er 4.5 / Bottom Layer 0.035mm

## Design rules (mm)
template: JLCPCB Capability(Two Layers Board)
spacing copperThickness1oz (default): track to track 0.102, other pairs 0.152 to 0.3
spacing copperThickness2oz: track to track 0.203, other pairs 0.152 to 0.3
track width copperThickness1oz (default): min 0.127, default 0.254, max 2.54
track width copperThickness2oz: min 0.203, default 0.254, max 2.54
differential pair differentialPair (default): width min 0.127, default 0.254, max 2.54; gap min 0.152, default 0.152
via viaSize (default): diameter min 0.5, default 0.61, max 10; hole min 0.3, default 0.305, max 6.3

## Placement (name value [footprint] x y rotation side)
NOREF  -  [Pad_e0]  2.6 4 0 top
NOREF#2  -  [Pad_e10]  0 0 0 top
NOREF#3  -  [Pad_e3]  2.6 11.5 0 top
NOREF#4  -  [Pad_e9]  0 15.5 0 top
NOREF#5  -  [Pad_e8]  5.2 0 0 top
NOREF#6  -  [Pad_e4]  5.1 7.75 0 top
NOREF#7  -  [Pad_e5]  5.2 15.5 0 top

## Footprints (pads in the part's own frame, mm; a bottom-side part is the same pattern mirrored in y, then rotated)
Pad_e0
  round 1.524 hole 1.219: 3(0,0)
Pad_e3
  round 1.524 hole 1.219: 1(0,0)
Pad_e4
  round 1.524 hole 1.219: 2(0,0)
Pad_e5
  round 1.524 hole 1.219: 4(0,0)
Pad_e8
  round 1.524 hole 1.219: 4(0,0)
Pad_e9
  round 1.524 hole 1.219: 4(0,0)
Pad_e10
  round 1.524 hole 1.219: 4(0,0)

## Nets

Pads without a net: NOREF 3; NOREF#2 4; NOREF#3 1; NOREF#4 4; NOREF#5 4; NOREF#6 2; NOREF#7 4
